# EAGLE board LEDSubMatrixHighDensity (EAGLE 9.6.2), part 1 of 2
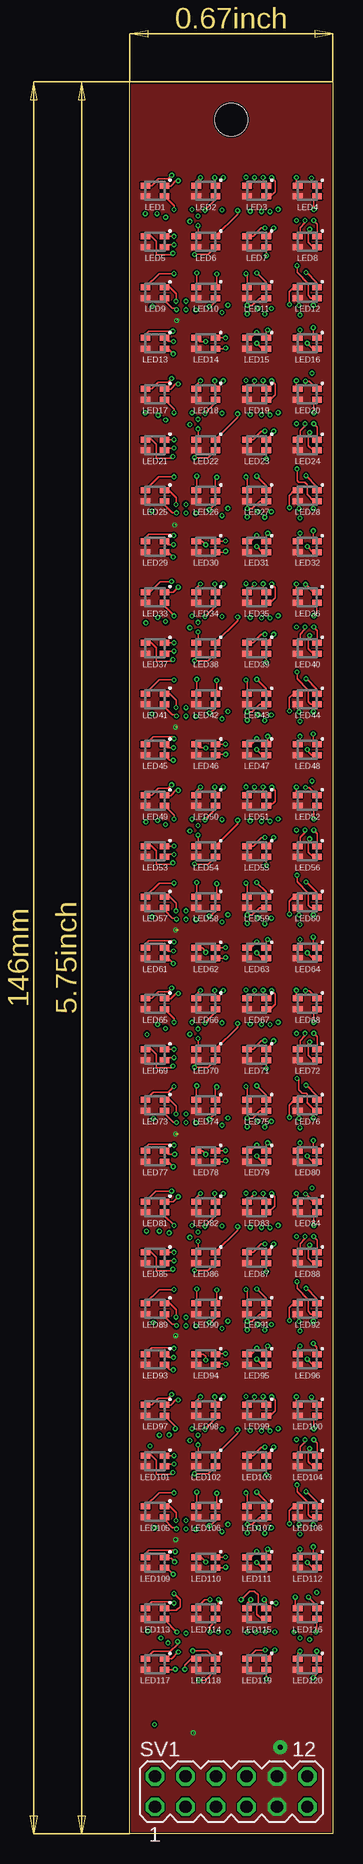
[diagram p3: board, top side]
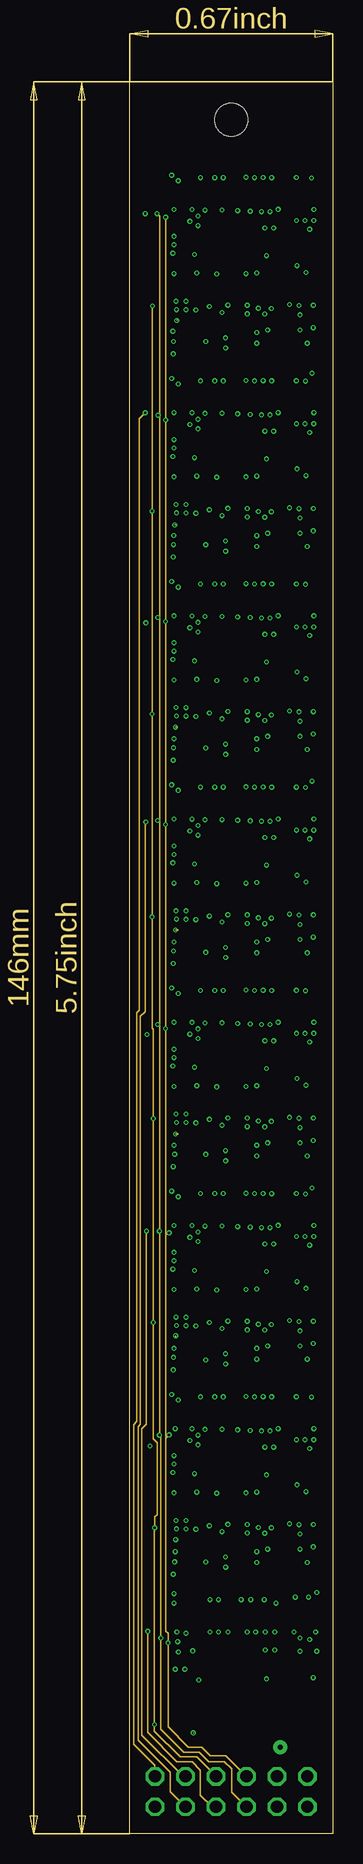
[diagram p4: board, inner layer InnerTop]
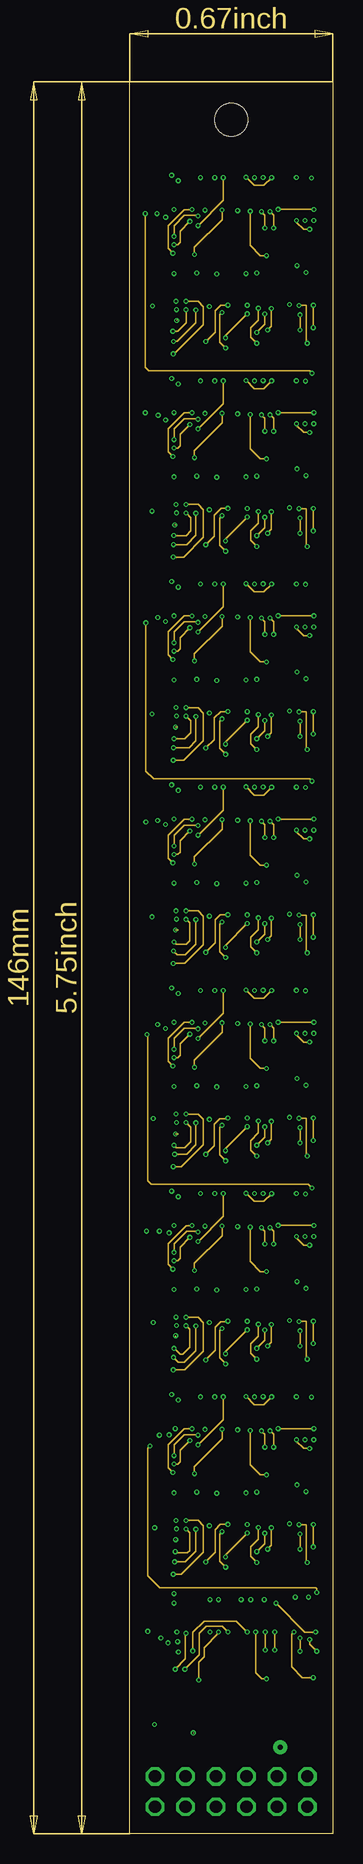
[diagram p5: board, inner layer InnerBottom]
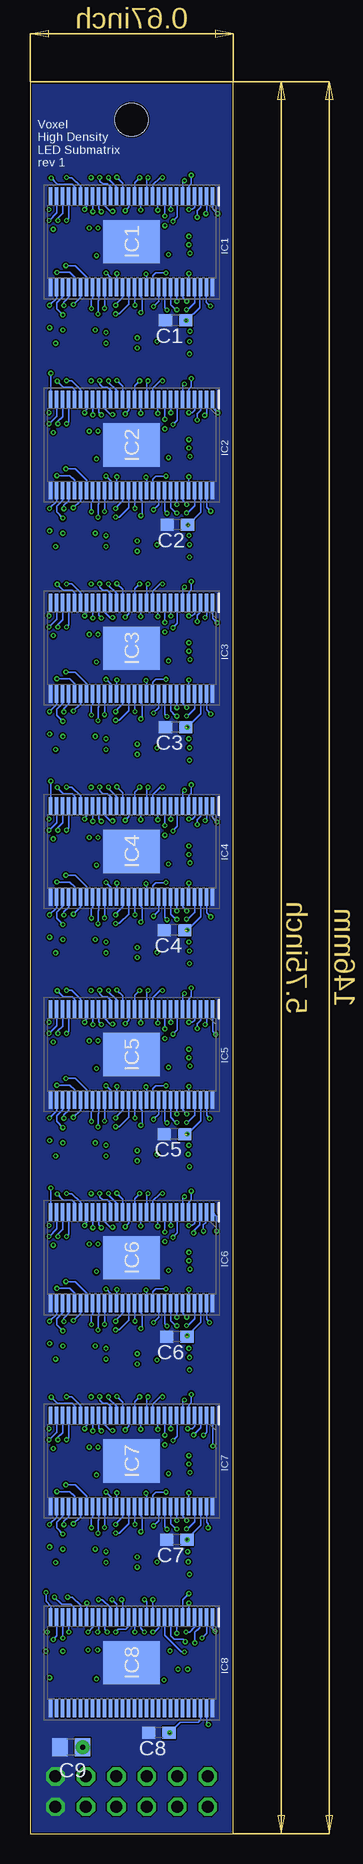
[diagram p6: board, bottom side, seen from below]

Size 16.93 x 146 mm. Coordinates in mm from the lower left corner, seen from the top.
Outline: 0,146 16.93,146 16.93,0 0,0 0,146
Copper layers (1+2*15+16): Top 0.035mm / dielectric 0.2mm / InnerTop 0.0175mm / dielectric 1.065mm / InnerBottom 0.0175mm / dielectric 0.2mm / Bottom 0.035mm
Design rules "jlcpcb_4layer_1oz": minimum track width 5mil, minimum drill 0.2mm, track to track 5mil, track to pad 0.2mm, pad to pad 5mil, via to via 6mil, smd to smd 5mil, copper to edge 5mil, drill to drill 0.5mm, minimum pad ring 10mil, minimum via ring 0.1mm, stop-mask expansion 4mil, vias tented up to drill 0mil, thermal gap 10mil
Holes 2.75 mm at 8.47,142.82

## Footprints (pad centres in the part's own frame; a part is rotated, then mirrored left to right if it is on the bottom)
C0603 = smd 1.1 x 1: 1 -0.85,0; 2 0.85,0
C0805 = smd 1.3 x 1.5: 1 -0.95,0; 2 0.95,0
SOP50P810X120-57N = smd 1.475 x 0.3: 1 -3.788,6.75; 2 -3.788,6.25; 3 -3.788,5.75; 4 -3.788,5.25; 5 -3.788,4.75; 6 -3.788,4.25; 7 -3.788,3.75; 8 -3.788,3.25; 9 -3.788,2.75; 10 -3.788,2.25; 11 -3.788,1.75; 12 -3.788,1.25; 13 -3.788,0.75; 14 -3.788,0.25; 15 -3.788,-0.25; 16 -3.788,-0.75; 17 -3.788,-1.25; 18 -3.788,-1.75; 19 -3.788,-2.25; 20 -3.788,-2.75; 21 -3.788,-3.25; 22 -3.788,-3.75; 23 -3.788,-4.25; 24 -3.788,-4.75; 25 -3.788,-5.25; 26 -3.788,-5.75; 27 -3.788,-6.25; 28 -3.788,-6.75; 29 3.788,-6.75; 30 3.788,-6.25; 31 3.788,-5.75; 32 3.788,-5.25; 33 3.788,-4.75; 34 3.788,-4.25; 35 3.788,-3.75; 36 3.788,-3.25; 37 3.788,-2.75; 38 3.788,-2.25; 39 3.788,-1.75; 40 3.788,-1.25; 41 3.788,-0.75; 42 3.788,-0.25; 43 3.788,0.25; 44 3.788,0.75; 45 3.788,1.25; 46 3.788,1.75; 47 3.788,2.25; 48 3.788,2.75; 49 3.788,3.25; 50 3.788,3.75; 51 3.788,4.25; 52 3.788,4.75; 53 3.788,5.25; 54 3.788,5.75; 55 3.788,6.25; 56 3.788,6.75 | smd 3.61 x 4.7: 57 0,0
B38G3RGB = smd 0.8 x 0.5: 1 0.8,0.45; 2 0.8,-0.45; 3 -0.8,-0.45; 4 -0.8,0.45
MA06-2 = drill 1.016 octagon: 1 -6.35,-1.27; 2 -6.35,1.27; 3 -3.81,-1.27; 4 -3.81,1.27; 5 -1.27,-1.27; 6 -1.27,1.27; 7 1.27,-1.27; 8 1.27,1.27; 9 3.81,-1.27; 10 3.81,1.27; 11 6.35,-1.27; 12 6.35,1.27

## Placement (x,y rotation side)
C1  .1uF  [C0603]  4.8,126.1 180 bottom
C2  .1uF  [C0603]  4.65,109.07 180 bottom
C3  .1uF  [C0603]  4.8,92.2 180 bottom
C4  .1uF  [C0603]  4.9,75.3 180 bottom
C5  .1uF  [C0603]  4.9,58.3 180 bottom
C6  .1uF  [C0603]  4.7,41.4 180 bottom
C7  .1uF  [C0603]  4.7,24.5 180 bottom
C8  .1uF  [C0603]  6.2,8.4 180 bottom
C9  10uF  [C0805]  13.5,7.2 180 bottom
IC1  TLC5955DCAR  [SOP50P810X120-57N]  8.47,132.65 270 bottom
IC2  TLC5955DCAR  [SOP50P810X120-57N]  8.47,115.72 270 bottom
IC3  TLC5955DCAR  [SOP50P810X120-57N]  8.47,98.78 270 bottom
IC4  TLC5955DCAR  [SOP50P810X120-57N]  8.47,81.85 270 bottom
IC5  TLC5955DCAR  [SOP50P810X120-57N]  8.47,64.92 270 bottom
IC6  TLC5955DCAR  [SOP50P810X120-57N]  8.47,47.98 270 bottom
IC7  TLC5955DCAR  [SOP50P810X120-57N]  8.47,31.05 270 bottom
IC8  TLC5955DCAR  [SOP50P810X120-57N]  8.47,14.23 270 bottom
LED1  B38G3RGB  [B38G3RGB]  2.12,136.88 0 top
LED2  B38G3RGB  [B38G3RGB]  6.35,136.88 0 top
LED3  B38G3RGB  [B38G3RGB]  10.58,136.88 0 top
LED4  B38G3RGB  [B38G3RGB]  14.82,136.88 0 top
LED5  B38G3RGB  [B38G3RGB]  2.12,132.65 0 top
LED6  B38G3RGB  [B38G3RGB]  6.35,132.65 0 top
LED7  B38G3RGB  [B38G3RGB]  10.58,132.65 0 top
LED8  B38G3RGB  [B38G3RGB]  14.82,132.65 0 top
LED9  B38G3RGB  [B38G3RGB]  2.12,128.42 0 top
LED10  B38G3RGB  [B38G3RGB]  6.35,128.42 0 top
LED11  B38G3RGB  [B38G3RGB]  10.58,128.42 0 top
LED12  B38G3RGB  [B38G3RGB]  14.82,128.42 0 top
LED13  B38G3RGB  [B38G3RGB]  2.12,124.18 0 top
LED14  B38G3RGB  [B38G3RGB]  6.35,124.18 0 top
LED15  B38G3RGB  [B38G3RGB]  10.58,124.18 0 top
LED16  B38G3RGB  [B38G3RGB]  14.82,124.18 0 top
LED17  B38G3RGB  [B38G3RGB]  2.12,119.95 0 top
LED18  B38G3RGB  [B38G3RGB]  6.35,119.95 0 top
LED19  B38G3RGB  [B38G3RGB]  10.58,119.95 0 top
LED20  B38G3RGB  [B38G3RGB]  14.82,119.95 0 top
LED21  B38G3RGB  [B38G3RGB]  2.12,115.72 0 top
LED22  B38G3RGB  [B38G3RGB]  6.35,115.72 0 top
LED23  B38G3RGB  [B38G3RGB]  10.58,115.72 0 top
LED24  B38G3RGB  [B38G3RGB]  14.82,115.72 0 top
LED25  B38G3RGB  [B38G3RGB]  2.12,111.48 0 top
LED26  B38G3RGB  [B38G3RGB]  6.35,111.48 0 top
LED27  B38G3RGB  [B38G3RGB]  10.58,111.48 0 top
LED28  B38G3RGB  [B38G3RGB]  14.82,111.48 0 top
LED29  B38G3RGB  [B38G3RGB]  2.12,107.25 0 top
LED30  B38G3RGB  [B38G3RGB]  6.35,107.25 0 top
LED31  B38G3RGB  [B38G3RGB]  10.58,107.25 0 top
LED32  B38G3RGB  [B38G3RGB]  14.82,107.25 0 top
LED33  B38G3RGB  [B38G3RGB]  2.12,103.02 0 top
LED34  B38G3RGB  [B38G3RGB]  6.35,103.02 0 top
LED35  B38G3RGB  [B38G3RGB]  10.58,103.02 0 top
LED36  B38G3RGB  [B38G3RGB]  14.82,103.02 0 top
LED37  B38G3RGB  [B38G3RGB]  2.12,98.78 0 top
LED38  B38G3RGB  [B38G3RGB]  6.35,98.78 0 top
LED39  B38G3RGB  [B38G3RGB]  10.58,98.78 0 top
LED40  B38G3RGB  [B38G3RGB]  14.82,98.78 0 top
LED41  B38G3RGB  [B38G3RGB]  2.12,94.55 0 top
LED42  B38G3RGB  [B38G3RGB]  6.35,94.55 0 top
LED43  B38G3RGB  [B38G3RGB]  10.58,94.55 0 top
LED44  B38G3RGB  [B38G3RGB]  14.82,94.55 0 top
LED45  B38G3RGB  [B38G3RGB]  2.12,90.32 0 top
LED46  B38G3RGB  [B38G3RGB]  6.35,90.32 0 top
LED47  B38G3RGB  [B38G3RGB]  10.58,90.32 0 top
LED48  B38G3RGB  [B38G3RGB]  14.82,90.32 0 top
LED49  B38G3RGB  [B38G3RGB]  2.12,86.08 0 top
LED50  B38G3RGB  [B38G3RGB]  6.35,86.08 0 top
LED51  B38G3RGB  [B38G3RGB]  10.58,86.08 0 top
LED52  B38G3RGB  [B38G3RGB]  14.82,86.08 0 top
LED53  B38G3RGB  [B38G3RGB]  2.12,81.85 0 top
LED54  B38G3RGB  [B38G3RGB]  6.35,81.85 0 top
LED55  B38G3RGB  [B38G3RGB]  10.58,81.85 0 top
LED56  B38G3RGB  [B38G3RGB]  14.82,81.85 0 top
LED57  B38G3RGB  [B38G3RGB]  2.12,77.62 0 top
LED58  B38G3RGB  [B38G3RGB]  6.35,77.62 0 top
LED59  B38G3RGB  [B38G3RGB]  10.58,77.62 0 top
LED60  B38G3RGB  [B38G3RGB]  14.82,77.62 0 top
LED61  B38G3RGB  [B38G3RGB]  2.12,73.38 0 top
LED62  B38G3RGB  [B38G3RGB]  6.35,73.38 0 top
LED63  B38G3RGB  [B38G3RGB]  10.58,73.38 0 top
LED64  B38G3RGB  [B38G3RGB]  14.82,73.38 0 top
LED65  B38G3RGB  [B38G3RGB]  2.12,69.15 0 top
LED66  B38G3RGB  [B38G3RGB]  6.35,69.15 0 top
LED67  B38G3RGB  [B38G3RGB]  10.58,69.15 0 top
LED68  B38G3RGB  [B38G3RGB]  14.82,69.15 0 top
LED69  B38G3RGB  [B38G3RGB]  2.12,64.92 0 top
LED70  B38G3RGB  [B38G3RGB]  6.35,64.92 0 top
LED71  B38G3RGB  [B38G3RGB]  10.58,64.92 0 top
LED72  B38G3RGB  [B38G3RGB]  14.82,64.92 0 top
LED73  B38G3RGB  [B38G3RGB]  2.12,60.68 0 top
LED74  B38G3RGB  [B38G3RGB]  6.35,60.68 0 top
LED75  B38G3RGB  [B38G3RGB]  10.58,60.68 0 top
LED76  B38G3RGB  [B38G3RGB]  14.82,60.68 0 top
LED77  B38G3RGB  [B38G3RGB]  2.12,56.45 0 top
LED78  B38G3RGB  [B38G3RGB]  6.35,56.45 0 top
LED79  B38G3RGB  [B38G3RGB]  10.58,56.45 0 top
LED80  B38G3RGB  [B38G3RGB]  14.82,56.45 0 top
LED81  B38G3RGB  [B38G3RGB]  2.12,52.22 0 top
LED82  B38G3RGB  [B38G3RGB]  6.35,52.22 0 top
LED83  B38G3RGB  [B38G3RGB]  10.58,52.22 0 top
LED84  B38G3RGB  [B38G3RGB]  14.82,52.22 0 top
LED85  B38G3RGB  [B38G3RGB]  2.12,47.98 0 top
LED86  B38G3RGB  [B38G3RGB]  6.35,47.98 0 top
LED87  B38G3RGB  [B38G3RGB]  10.58,47.98 0 top
LED88  B38G3RGB  [B38G3RGB]  14.82,47.98 0 top
LED89  B38G3RGB  [B38G3RGB]  2.12,43.75 0 top
LED90  B38G3RGB  [B38G3RGB]  6.35,43.75 0 top
LED91  B38G3RGB  [B38G3RGB]  10.58,43.75 0 top
LED92  B38G3RGB  [B38G3RGB]  14.82,43.75 0 top
LED93  B38G3RGB  [B38G3RGB]  2.12,39.52 0 top
LED94  B38G3RGB  [B38G3RGB]  6.35,39.52 0 top
LED95  B38G3RGB  [B38G3RGB]  10.58,39.52 0 top
LED96  B38G3RGB  [B38G3RGB]  14.82,39.52 0 top
LED97  B38G3RGB  [B38G3RGB]  2.12,35.28 0 top
LED98  B38G3RGB  [B38G3RGB]  6.35,35.28 0 top
LED99  B38G3RGB  [B38G3RGB]  10.58,35.28 0 top
LED100  B38G3RGB  [B38G3RGB]  14.82,35.28 0 top
LED101  B38G3RGB  [B38G3RGB]  2.12,31.05 0 top
LED102  B38G3RGB  [B38G3RGB]  6.35,31.05 0 top
LED103  B38G3RGB  [B38G3RGB]  10.58,31.05 0 top
LED104  B38G3RGB  [B38G3RGB]  14.82,31.05 0 top
LED105  B38G3RGB  [B38G3RGB]  2.12,26.82 0 top
LED106  B38G3RGB  [B38G3RGB]  6.35,26.82 0 top
LED107  B38G3RGB  [B38G3RGB]  10.58,26.82 0 top
LED108  B38G3RGB  [B38G3RGB]  14.82,26.82 0 top
LED109  B38G3RGB  [B38G3RGB]  2.12,22.58 0 top
LED110  B38G3RGB  [B38G3RGB]  6.35,22.58 0 top
LED111  B38G3RGB  [B38G3RGB]  10.58,22.58 0 top
LED112  B38G3RGB  [B38G3RGB]  14.82,22.58 0 top
LED113  B38G3RGB  [B38G3RGB]  2.12,18.35 0 top
LED114  B38G3RGB  [B38G3RGB]  6.35,18.35 0 top
LED115  B38G3RGB  [B38G3RGB]  10.58,18.35 0 top
LED116  B38G3RGB  [B38G3RGB]  14.82,18.35 0 top
LED117  B38G3RGB  [B38G3RGB]  2.12,14.12 0 top
LED118  B38G3RGB  [B38G3RGB]  6.35,14.12 0 top
LED119  B38G3RGB  [B38G3RGB]  10.58,14.12 0 top
LED120  B38G3RGB  [B38G3RGB]  14.82,14.12 0 top
SV1  [MA06-2]  8.47,3.5 0 top

## Tracks (layer width: path | path; a pad name or v marks a point on that pad's centre or on a via)
3V3  (via drill 0.2, 0.4 pad 1.15)  (8 unrouted)
  Bottom 0.127: IC7.54 2.72,25.68 3.84,24.56 v3.84,24.5 | IC6.54 2.72,42.62 v3.84,41.5 | IC2.54 2.72,110.09 v3.76,109.05 | IC3.54 2.72,93.3 v3.82,92.2 | IC4.54 2.72,76.4 v3.82,75.3 | IC5.54 2.72,59.4 v3.82,58.3 | IC1.54 2.8,128.78 2.8,127.16 3.87,126.1 v3.92,126.1 | IC8.54 2.72,9.48 2.9,9.3 4.4,9.3 v5.3,8.4
  other vias: 12.55,7.2
  pour Top (no thermals): -20,166 40,166 40,-6 -20,-6
GND
  pour Bottom (no thermals): -20,166 38.2,166 38.2,-3 -20,-3
GSCLK  (via drill 0.2)
  InnerTop 0.127: v1.9,127.3 1.87,127.27 v1.87,110.2 v1.87,93.3 v1.87,76.4 1.87,67.13 1.97,67.03 v1.97,59.6 v1.97,42.6 v1.98,42.59 1.98,32.9 2.29,32.59 2.29,26.59 2.09,26.39 v2.09,25.49 2.07,25.47 v2.07,9.1 2.07,8.53 4.2,6.4 5.6,6.4 7.2,4.8 SV1.6
  Bottom 0.127: IC1.55 2.23,127.61 1.92,127.3 v1.9,127.3 | IC3.55 2.22,93.65 v1.87,93.3 | IC6.55 2.22,42.85 v1.97,42.6 | IC5.55 2.22,59.85 v1.97,59.6 | IC4.55 2.22,76.75 v1.87,76.4 | IC2.55 2.22,110.55 v1.87,110.2 | IC7.55 2.22,25.95 2.09,25.82 v2.09,25.49 | IC8.55 2.22,9.25 v2.07,9.1
LAT  (via drill 0.2)
  InnerTop 0.127: 3.02,32.95 3.02,16.88 3.2,16.7 v3.2,15.9 3.2,8.9 4.9,7.2 6,7.2 6.7,6.5 8.01,6.5 SV1.8 | v3,134.7 v3,117.8 v3,101 v3,84.1 v3,67.1 3,49.98 3.02,49.96 | v3.3,50.06 3.2,49.96 3.02,49.96 | v3.3,33.23 3.02,32.95 | 3.02,49.96 3.02,32.95
  Bottom 0.127: IC1.3 2.72,135.54 3,135.25 v3,134.7 | IC2.3 2.72,118.61 3,118.32 v3,117.8 | IC4.3 2.72,84.78 3,84.5 v3,84.1 | IC5.3 2.72,67.78 3,67.5 v3,67.1 | IC3.3 2.8,102.48 2.8,101.72 3,101.52 v3,101 | IC6.3 2.8,51.69 2.8,50.75 3.3,50.25 v3.3,50.06 | IC7.3 2.72,33.81 v3.3,33.23 | IC8.3 2.8,17.94 2.8,17.18 3.2,16.78 v3.2,15.9
N$LEDB1_IC1_PIN4  (via drill 0.2 pad 0.4)
  Top 0.127: LED1.2 3.7,135.65 v3.7,135.35
  Bottom 0.127: IC1.4 3.22,135.53 3.4,135.35 v3.7,135.35
N$LEDB2_IC1_PIN10  (via drill 0.2)
  Top 0.127: v6.28,135.29 7.15,136.16 LED2.2
  Bottom 0.127: IC1.10 6.28,136.37 v6.28,135.29
N$LEDB3_IC1_PIN16  (via drill 0.2)
  Top 0.127: v11.84,138 12.14,137.7 12.14,136.84 11.73,136.43 LED3.2
  InnerBottom 0.127: v11.84,138 11.18,137.35 10.38,137.35 v9.7,138.03
  Bottom 0.127: IC1.16 9.22,137.55 v9.7,138.03
N$LEDB4_IC1_PIN22  (via drill 0.2)
  Top 0.127: LED4.2 15.35,136.17 v15.35,135.35
  InnerBottom 0.127: v15.35,135.35 v12.38,135.35
  Bottom 0.127: IC1.22 12.22,135.63 12.38,135.46 v12.38,135.35
N$LEDB5_IC1_PIN7  (via drill 0.2 pad 0.4)
  Top 0.127: v3.7,132.4 3.12,132.4 LED5.2
  InnerBottom 0.127: v5.02,134.36 4.2,133.54 4.2,132.6 4,132.4 v3.7,132.4
  Bottom 0.127: IC1.7 4.65,136.37 4.65,134.73 v5.02,134.36
N$LEDB6_IC1_PIN13  (via drill 0.2)
  Top 0.127: v5.4,131.6 6.55,131.6 LED6.2
  InnerBottom 0.127: v7.71,135.29 7.71,134.49 5.4,132.19 v5.4,131.6
  Bottom 0.127: IC1.13 7.72,135.3 v7.71,135.29
N$LEDB7_IC1_PIN19  (via drill 0.2)
  Top 0.127: v11.4,131.5 11.38,131.52 LED7.2
  InnerBottom 0.127: v10.05,135.2 10.05,132.35 10.9,131.5 v11.4,131.5
  Bottom 0.127: IC1.19 10.72,135.67 10.25,135.2 v10.05,135.2
N$LEDB8_IC1_PIN25  (via drill 0.2)
  Top 0.127: v15,133.7 14.9,133.6 14.9,132.6 15.3,132.2 LED8.2
  InnerBottom 0.127: v15,133.7 14.5,133.7 13.9,134.3 v13.9,134.42
  Bottom 0.127: IC1.25 13.72,134.61 v13.9,134.42
N$LEDB9_IC1_PIN53  (via drill 0.2)
  Top 0.127: v3.9,127 3.8,127.1 3.56,127.1 2.92,127.74 LED9.2
  Bottom 0.127: IC1.53 3.22,127.58 3.8,127 v3.9,127
N$LEDB10_IC1_PIN47  (via drill 0.2)
  Top 0.127: v6.65,127.25 6.74,127.25 7.15,127.67 LED10.2
  Bottom 0.127: IC1.47 6.22,127.68 v6.65,127.25
N$LEDB11_IC1_PIN41  (via drill 0.2)
  Top 0.127: v9.8,127.36 v9.8,127.37 10.23,127.37 10.83,127.97 LED11.2
  Bottom 0.127: IC1.41 9.22,128.02 9.8,127.44 v9.8,127.36
N$LEDB12_IC1_PIN35  (via drill 0.2)
  Top 0.127: v13.95,130.66 13.95,130.11 14.9,129.16 14.9,128.18 15.11,127.97 LED12.2
  Bottom 0.127: IC1.35 12.22,129.7 13.17,130.66 v13.95,130.66
N$LEDB13_IC1_PIN50  (via drill 0.2)
  Top 0.127: v3.64,123.31 3.22,123.73 LED13.2
  InnerBottom 0.127: v4.69,127.7 5.7,127.7 6.15,127.25 6.15,125.75 3.71,123.31 v3.64,123.31
  Bottom 0.127: IC1.50 4.72,127.72 v4.69,127.7
N$LEDB14_IC1_PIN44  (via drill 0.2)
  Top 0.127: v8,123.8 7.93,123.73 LED14.2
  InnerBottom 0.127: v7.7,126.76 7.5,126.56 7.5,124.3 v8,123.8
  Bottom 0.127: IC1.44 7.72,128.08 7.6,127.96 7.6,126.86 v7.7,126.76
N$LEDB15_IC1_PIN38  (via drill 0.2)
  Top 0.127: LED15.2 11.07,123.73 v10.6,124.2
  InnerBottom 0.127: v10.6,124.2 10.1,124.7 10.1,125.49 10.73,126.12 v10.73,127.11
  Bottom 0.127: IC1.38 10.72,127.13 v10.73,127.11
N$LEDB16_IC1_PIN32  (via drill 0.2)
  Top 0.127: v14.8,124.2 15.27,123.73 LED16.2
  InnerBottom 0.127: v14.11,127.34 14.7,127.34 14.7,124.3 v14.8,124.2
  Bottom 0.127: IC1.32 13.72,128.02 14.11,127.62 v14.11,127.34
N$LEDB17_IC2_PIN4  (via drill 0.2 pad 0.4)
  Top 0.127: LED17.2 3.7,118.72 v3.7,118.41
  Bottom 0.127: IC2.4 3.22,118.6 3.4,118.41 v3.7,118.41
N$LEDB18_IC2_PIN10  (via drill 0.2)
  Top 0.127: v6.28,118.36 7.15,119.23 LED18.2
  Bottom 0.127: IC2.10 6.28,119.44 v6.28,118.36
N$LEDB19_IC2_PIN16  (via drill 0.2)
  Top 0.127: v11.84,121.07 12.14,120.77 12.14,119.9 11.73,119.5 LED19.2
  InnerBottom 0.127: v11.84,121.07 11.18,120.41 10.38,120.41 v9.7,121.1
  Bottom 0.127: IC2.16 9.22,120.61 v9.7,121.1
N$LEDB20_IC2_PIN22  (via drill 0.2)
  Top 0.127: LED20.2 15.35,119.24 v15.35,118.41
  InnerBottom 0.127: v15.35,118.41 v15.35,118.42 v12.38,118.42
  Bottom 0.127: IC2.22 12.22,118.69 12.38,118.53 v12.38,118.42
N$LEDB21_IC2_PIN7  (via drill 0.2 pad 0.4)
  Top 0.127: v3.7,115.47 3.12,115.47 LED21.2
  InnerBottom 0.127: v5.02,117.42 4.2,116.61 4.2,115.67 4,115.47 v3.7,115.47
  Bottom 0.127: IC2.7 4.65,119.44 4.65,117.79 v5.02,117.42
N$LEDB22_IC2_PIN13  (via drill 0.2)
  Top 0.127: v5.4,114.66 6.55,114.66 LED22.2
  InnerBottom 0.127: v7.71,118.36 7.71,117.56 5.4,115.25 v5.4,114.66
  Bottom 0.127: IC2.13 v7.72,118.37 v7.71,118.36
N$LEDB23_IC2_PIN19  (via drill 0.2)
  Top 0.127: v11.4,114.57 11.38,114.58 LED23.2
  InnerBottom 0.127: v10.05,118.27 10.05,115.42 10.9,114.57 v11.4,114.57
  Bottom 0.127: IC2.19 10.72,118.73 10.25,118.27 v10.05,118.27
N$LEDB24_IC2_PIN25  (via drill 0.2)
  Top 0.127: v15,116.77 14.9,116.67 14.9,115.67 15.3,115.27 LED24.2
  InnerBottom 0.127: v15,116.77 14.5,116.77 13.9,117.37 v13.9,117.49
  Bottom 0.127: IC2.25 13.72,117.67 v13.9,117.49
N$LEDB25_IC2_PIN53  (via drill 0.2)
  Top 0.127: LED25.2 2.92,110.68 3.53,110.07 v3.9,110.07
  Bottom 0.127: IC2.53 3.22,110.65 3.8,110.07 v3.9,110.07
N$LEDB26_IC2_PIN47  (via drill 0.2)
  Top 0.127: v6.65,110.32 7.15,110.82 LED26.2
  Bottom 0.127: IC2.47 6.22,110.75 v6.65,110.32
N$LEDB27_IC2_PIN41  (via drill 0.2)
  Top 0.127: v9.8,110.43 10.23,110.43 10.83,111.03 LED27.2 | LED27.2
  Bottom 0.127: IC2.41 9.22,111.09 9.8,110.5 v9.8,110.43
N$LEDB28_IC2_PIN35  (via drill 0.2)
  Top 0.127: v13.95,113.73 13.95,112.75 14.1,112.6 14.6,112.6 14.8,112.4 14.8,111.6 15.37,111.03 LED28.2
  Bottom 0.127: IC2.35 12.22,112.77 13.17,113.73 v13.95,113.73
N$LEDB29_IC2_PIN50  (via drill 0.2)
  Top 0.127: v3.64,106.38 3.22,106.8 LED29.2
  InnerBottom 0.127: v4.69,110.77 5.7,110.77 6.15,110.31 6.15,108.02 4.51,106.38 v3.64,106.38
  Bottom 0.127: IC2.50 4.72,110.79 v4.69,110.77
N$LEDB30_IC2_PIN44  (via drill 0.2)
  Top 0.127: v8,106.87 7.93,106.8 LED30.2
  InnerBottom 0.127: v7.7,109.83 7.5,109.63 7.5,107.37 v8,106.87
  Bottom 0.127: IC2.44 7.72,111.15 7.6,111.03 7.6,109.93 v7.7,109.83
N$LEDB31_IC2_PIN38  (via drill 0.2)
  Top 0.127: LED31.2 11.07,106.8 v10.6,107.27
  InnerBottom 0.127: v10.6,107.27 10.1,107.77 10.1,108.56 10.73,109.19 v10.73,110.18
  Bottom 0.127: IC2.38 10.72,110.19 v10.73,110.18
N$LEDB32_IC2_PIN32  (via drill 0.2)
  Top 0.127: v14.8,107.27 15.27,106.8 LED32.2
  InnerBottom 0.127: v14.11,110.41 14.7,110.41 14.7,107.37 v14.8,107.27
  Bottom 0.127: IC2.32 13.72,111.08 14.11,110.69 v14.11,110.41
N$LEDB33_IC3_PIN4  (via drill 0.2 pad 0.4)
  Top 0.127: LED33.2 2.92,102.27 v3.7,101.48
  Bottom 0.127: IC3.4 3.22,101.66 3.4,101.48 v3.7,101.48
N$LEDB34_IC3_PIN10  (via drill 0.2)
  Top 0.127: LED34.2 7.15,102.29 v6.28,101.42
  Bottom 0.127: IC3.10 6.28,102.51 v6.28,101.42
N$LEDB35_IC3_PIN16  (via drill 0.2)
  Top 0.127: v11.84,104.13 12.14,103.83 12.14,102.97 11.73,102.57 LED35.2
  InnerBottom 0.127: v11.84,104.13 11.18,103.48 10.38,103.48 v9.7,104.16
  Bottom 0.127: IC3.16 9.22,103.68 v9.7,104.16
N$LEDB36_IC3_PIN22  (via drill 0.2)
  Top 0.127: v15.35,101.48 15.62,101.74 LED36.2
  InnerBottom 0.127: v15.35,101.48 v12.38,101.48
  Bottom 0.127: IC3.22 12.22,101.76 12.38,101.6 v12.38,101.48
N$LEDB37_IC3_PIN7  (via drill 0.2 pad 0.4)
  Top 0.127: v3.7,98.53 3.12,98.53 LED37.2
  InnerBottom 0.127: v5.02,100.49 4.2,99.67 4.2,98.73 4,98.53 v3.7,98.53
  Bottom 0.127: IC3.7 4.65,102.5 4.65,100.86 v5.02,100.49
N$LEDB38_IC3_PIN13  (via drill 0.2)
  Top 0.127: v5.4,97.73 6.55,97.73 LED38.2
  InnerBottom 0.127: v7.71,101.43 7.71,100.63 5.4,98.32 v5.4,97.73
  Bottom 0.127: IC3.13 v7.72,101.44 v7.71,101.43
N$LEDB39_IC3_PIN19  (via drill 0.2)
  Top 0.127: v11.4,97.63 11.38,97.65 LED39.2
  InnerBottom 0.127: v10.05,101.33 10.05,98.48 10.9,97.63 v11.4,97.63
  Bottom 0.127: IC3.19 10.72,101.8 10.25,101.33 v10.05,101.33
N$LEDB40_IC3_PIN25  (via drill 0.2)
  Top 0.127: v15,99.83 14.9,99.73 14.9,98.73 15.3,98.33 LED40.2
  InnerBottom 0.127: v15,99.83 14.5,99.83 13.9,100.43 v13.9,100.56
  Bottom 0.127: IC3.25 13.72,100.74 v13.9,100.56
N$LEDB41_IC3_PIN53  (via drill 0.2)
  Top 0.127: v3.9,93.13 3.8,93.23 3.56,93.23 2.92,93.88 LED41.2
  Bottom 0.127: IC3.53 3.22,93.72 3.8,93.13 v3.9,93.13
N$LEDB42_IC3_PIN47  (via drill 0.2)
  Top 0.127: v6.65,93.39 6.74,93.39 7.15,93.8 LED42.2
  Bottom 0.127: IC3.47 6.22,93.82 v6.65,93.39
N$LEDB43_IC3_PIN41  (via drill 0.2)
  Top 0.127: v9.8,93.5 10.23,93.5 10.83,94.1 LED43.2
  Bottom 0.127: IC3.41 9.22,94.15 9.8,93.57 v9.8,93.5
N$LEDB44_IC3_PIN35  (via drill 0.2)
  Top 0.127: v13.95,96.79 13.95,96.24 14.9,95.29 14.9,94.31 15.11,94.1 LED44.2
  Bottom 0.127: IC3.35 12.22,95.84 13.17,96.79 v13.95,96.79
N$LEDB45_IC3_PIN50  (via drill 0.2)
  Top 0.127: v3.64,89.45 3.34,89.45 LED45.2
  InnerBottom 0.127: v4.69,93.83 5.7,93.83 6.15,93.38 6.15,91.09 4.51,89.45 v3.64,89.45
  Bottom 0.127: IC3.50 4.72,93.86 v4.69,93.83
N$LEDB46_IC3_PIN44  (via drill 0.2)
  Top 0.127: LED46.2 7.22,89.93 v8,89.93
  InnerBottom 0.127: v7.7,92.9 7.5,92.7 7.5,90.43 v8,89.93
  Bottom 0.127: IC3.44 7.72,94.21 7.6,94.1 7.6,93 v7.7,92.9
N$LEDB47_IC3_PIN38  (via drill 0.2)
  Top 0.127: 11.08,89.87 11.07,89.87 v10.6,90.33 | LED47.2 11.08,89.87 | 11.08,89.87
  InnerBottom 0.127: v10.6,90.33 10.1,90.83 10.1,91.62 10.73,92.26 v10.73,93.24
  Bottom 0.127: IC3.38 10.72,93.26 v10.73,93.24
N$LEDB48_IC3_PIN32  (via drill 0.2)
  Top 0.127: LED48.2 15.17,89.87 14.8,90.23 v14.8,90.33
  InnerBottom 0.127: v14.11,93.48 14.7,93.48 14.7,90.43 v14.8,90.33
  Bottom 0.127: IC3.32 13.72,94.15 14.11,93.76 v14.11,93.48
N$LEDB49_IC4_PIN4  (via drill 0.2 pad 0.4)
  Top 0.127: LED49.2 3.7,84.85 v3.7,84.55
  Bottom 0.127: IC4.4 3.22,84.73 3.4,84.55 v3.7,84.55
N$LEDB50_IC4_PIN10  (via drill 0.2)
  Top 0.127: v6.28,84.49 7.15,85.36 LED50.2
  Bottom 0.127: IC4.10 6.28,85.57 v6.28,84.49
N$LEDB51_IC4_PIN16  (via drill 0.2)
  Top 0.127: v11.84,87.2 12.14,86.9 12.14,86.04 11.73,85.63 LED51.2
  InnerBottom 0.127: v11.84,87.2 11.18,86.55 10.38,86.55 v9.7,87.23
  Bottom 0.127: IC4.16 9.22,86.75 v9.7,87.23
N$LEDB52_IC4_PIN22  (via drill 0.2)
  Top 0.127: LED52.2 15.35,85.37 v15.35,84.55
  InnerBottom 0.127: v15.35,84.55 v12.38,84.55
  Bottom 0.127: IC4.22 12.22,84.83 12.38,84.66 v12.38,84.55
N$LEDB53_IC4_PIN7  (via drill 0.2 pad 0.4)
  Top 0.127: v3.7,81.6 3.12,81.6 LED53.2
  InnerBottom 0.127: v5.02,83.56 4.2,82.74 4.2,81.8 4,81.6 v3.7,81.6
  Bottom 0.127: IC4.7 4.65,85.57 4.65,83.93 v5.02,83.56
N$LEDB54_IC4_PIN13  (via drill 0.2)
  Top 0.127: v5.4,80.8 6.55,80.8 LED54.2
  InnerBottom 0.127: v7.71,84.49 7.71,83.69 5.4,81.39 v5.4,80.8
  Bottom 0.127: IC4.13 7.72,84.5 v7.71,84.49
N$LEDB55_IC4_PIN19  (via drill 0.2)
  Top 0.127: v11.4,80.7 11.38,80.72 LED55.2
  InnerBottom 0.127: v10.05,84.4 10.05,81.55 10.9,80.7 v11.4,80.7
  Bottom 0.127: IC4.19 10.72,84.87 10.25,84.4 v10.05,84.4
N$LEDB56_IC4_PIN25  (via drill 0.2)
  Top 0.127: v15,82.9 14.9,82.8 14.9,81.8 15.3,81.4 LED56.2
  InnerBottom 0.127: v15,82.9 14.5,82.9 13.9,83.5 v13.9,83.62
  Bottom 0.127: IC4.25 13.72,83.81 v13.9,83.62
N$LEDB57_IC4_PIN53  (via drill 0.2)
  Top 0.127: v3.9,76.2 3.8,76.3 3.56,76.3 2.92,76.94 LED57.2
  Bottom 0.127: IC4.53 3.22,76.78 3.8,76.2 v3.9,76.2
N$LEDB58_IC4_PIN47  (via drill 0.2)
  Top 0.127: v6.65,76.45 6.74,76.45 7.15,76.87 LED58.2
  Bottom 0.127: IC4.47 6.22,76.88 v6.65,76.45
N$LEDB59_IC4_PIN41  (via drill 0.2)
  Top 0.127: v9.8,76.56 v9.8,76.57 10.23,76.57 10.83,77.17 LED59.2
  Bottom 0.127: IC4.41 9.22,77.22 9.8,76.64 v9.8,76.56
N$LEDB60_IC4_PIN35  (via drill 0.2)
  Top 0.127: v13.95,79.86 13.95,79.31 14.9,78.36 14.9,77.38 15.11,77.17 LED60.2
  Bottom 0.127: IC4.35 12.22,78.9 13.17,79.86 v13.95,79.86
N$LEDB61_IC4_PIN50  (via drill 0.2)
  Top 0.127: v3.64,72.51 3.22,72.93 LED61.2
  InnerBottom 0.127: v4.69,76.9 5.7,76.9 6.15,76.45 6.15,74.05 4.61,72.51 v3.64,72.51
  Bottom 0.127: IC4.50 4.72,76.92 v4.69,76.9
N$LEDB62_IC4_PIN44  (via drill 0.2)
  Top 0.127: v8,73 7.93,72.93 LED62.2
  InnerBottom 0.127: v7.7,75.96 7.5,75.76 7.5,73.5 v8,73
  Bottom 0.127: IC4.44 7.72,77.28 7.6,77.16 7.6,76.06 v7.7,75.96
N$LEDB63_IC4_PIN38  (via drill 0.2)
  Top 0.127: LED63.2 11.07,72.93 v10.6,73.4
  InnerBottom 0.127: v10.6,73.4 10.1,73.9 10.1,74.69 10.73,75.32 v10.73,76.31
  Bottom 0.127: IC4.38 10.72,76.33 v10.73,76.31
N$LEDB64_IC4_PIN32  (via drill 0.2)
  Top 0.127: v14.8,73.4 15.27,72.93 LED64.2
  InnerBottom 0.127: v14.11,76.54 14.7,76.54 14.7,73.5 v14.8,73.4
  Bottom 0.127: IC4.32 13.72,77.22 14.11,76.82 v14.11,76.54
N$LEDB65_IC5_PIN4  (via drill 0.2 pad 0.4)
  Top 0.127: LED65.2 3.7,67.92 v3.7,67.61
  Bottom 0.127: IC5.4 3.22,67.8 3.4,67.61 v3.7,67.61
N$LEDB66_IC5_PIN10  (via drill 0.2)
  Top 0.127: v6.28,67.56 7.15,68.43 LED66.2
  Bottom 0.127: IC5.10 6.28,68.64 v6.28,67.56
N$LEDB67_IC5_PIN16  (via drill 0.2)
  Top 0.127: v11.84,70.27 12.14,69.97 12.14,69.1 11.73,68.7 LED67.2
  InnerBottom 0.127: v11.84,70.27 11.18,69.61 10.38,69.61 v9.7,70.3
  Bottom 0.127: IC5.16 9.22,69.81 v9.7,70.3
N$LEDB68_IC5_PIN22  (via drill 0.2)
  Top 0.127: LED68.2 15.35,68.44 v15.35,67.61
  InnerBottom 0.127: v15.35,67.61 v15.35,67.62 v12.38,67.62
  Bottom 0.127: IC5.22 12.22,67.89 12.38,67.73 v12.38,67.62
N$LEDB69_IC5_PIN7  (via drill 0.2 pad 0.4)
  Top 0.127: v3.7,64.67 3.12,64.67 LED69.2
  InnerBottom 0.127: v5.02,66.62 4.2,65.81 4.2,64.87 4,64.67 v3.7,64.67
  Bottom 0.127: IC5.7 4.65,68.64 4.65,66.99 v5.02,66.62
N$LEDB70_IC5_PIN13  (via drill 0.2)
  Top 0.127: v5.4,63.86 6.55,63.86 LED70.2
  InnerBottom 0.127: v7.71,67.56 7.71,66.76 5.4,64.45 v5.4,63.86
  Bottom 0.127: IC5.13 v7.72,67.57 v7.71,67.56
N$LEDB71_IC5_PIN19  (via drill 0.2)
  Top 0.127: v11.4,63.77 11.38,63.78 LED71.2
  InnerBottom 0.127: v10.05,67.47 10.05,64.62 10.9,63.77 v11.4,63.77
  Bottom 0.127: IC5.19 10.72,67.93 10.25,67.47 v10.05,67.47
N$LEDB72_IC5_PIN25  (via drill 0.2)
  Top 0.127: v15,65.97 14.9,65.87 14.9,64.87 15.3,64.47 LED72.2
  InnerBottom 0.127: v15,65.97 14.5,65.97 13.9,66.57 v13.9,66.69
  Bottom 0.127: IC5.25 13.72,66.87 v13.9,66.69
N$LEDB73_IC5_PIN53  (via drill 0.2)
  Top 0.127: LED73.2 2.92,59.98 3.63,59.27 v3.9,59.27
  Bottom 0.127: IC5.53 3.22,59.85 3.8,59.27 v3.9,59.27
N$LEDB74_IC5_PIN47  (via drill 0.2)
  Top 0.127: v6.65,59.52 7.15,60.02 LED74.2
  Bottom 0.127: IC5.47 6.22,59.95 v6.65,59.52
N$LEDB75_IC5_PIN41  (via drill 0.2)
  Top 0.127: v9.8,59.63 10.25,59.63 10.86,60.23 LED75.2
  Bottom 0.127: IC5.41 9.22,60.29 9.8,59.7 v9.8,59.63
N$LEDB76_IC5_PIN35  (via drill 0.2)
  Top 0.127: v13.95,62.93 14.1,62.78 14.1,62 14.4,61.7 14.7,61.7 14.8,61.6 14.8,60.9 15.47,60.23 LED76.2
  Bottom 0.127: IC5.35 12.22,61.97 13.17,62.93 v13.95,62.93
N$LEDB77_IC5_PIN50  (via drill 0.2)
  Top 0.127: v3.64,55.58 3.22,56 LED77.2
  InnerBottom 0.127: v4.69,59.97 5.7,59.97 6.15,59.52 6.15,57.42 4.31,55.58 v3.64,55.58
  Bottom 0.127: IC5.50 4.72,59.99 v4.69,59.97
N$LEDB78_IC5_PIN44  (via drill 0.2)
  Top 0.127: v8,56.07 7.93,56 LED78.2
  InnerBottom 0.127: v7.7,59.03 7.5,58.83 7.5,56.57 v8,56.07
  Bottom 0.127: IC5.44 7.72,60.35 7.6,60.23 7.6,59.13 v7.7,59.03
N$LEDB79_IC5_PIN38  (via drill 0.2)
  Top 0.127: LED79.2 11.07,56 v10.6,56.47
  InnerBottom 0.127: v10.6,56.47 10.1,56.97 10.1,57.76 10.73,58.39 v10.73,59.38
  Bottom 0.127: IC5.38 10.72,59.39 v10.73,59.38
N$LEDB80_IC5_PIN32  (via drill 0.2)
  Top 0.127: v14.8,56.47 15.27,56 LED80.2
  InnerBottom 0.127: v14.11,59.61 14.7,59.61 14.7,56.57 v14.8,56.47
  Bottom 0.127: IC5.32 13.72,60.28 14.11,59.89 v14.11,59.61
N$LEDB81_IC6_PIN4  (via drill 0.2 pad 0.4)
  Top 0.127: LED81.2 2.92,51.47 v3.7,50.68
  Bottom 0.127: IC6.4 3.22,50.86 3.4,50.68 v3.7,50.68
N$LEDB82_IC6_PIN10  (via drill 0.2)
  Top 0.127: LED82.2 7.15,51.49 v6.28,50.62
  Bottom 0.127: IC6.10 6.28,51.71 v6.28,50.62
N$LEDB83_IC6_PIN16  (via drill 0.2)
  Top 0.127: v11.84,53.33 12.1,53.07 12.1,52.3 11.57,51.77 LED83.2
  InnerBottom 0.127: v11.84,53.33 11.18,52.68 10.38,52.68 v9.7,53.36
  Bottom 0.127: IC6.16 9.22,52.88 v9.7,53.36
N$LEDB84_IC6_PIN22  (via drill 0.2)
  Top 0.127: v15.35,50.68 15.35,51.5 LED84.2 | LED84.2
  InnerBottom 0.127: v15.35,50.68 v12.38,50.68
  Bottom 0.127: IC6.22 12.22,50.96 12.38,50.8 v12.38,50.68
N$LEDB85_IC6_PIN7  (via drill 0.2 pad 0.4)
  Top 0.127: v3.7,47.73 3.12,47.73 LED85.2
  InnerBottom 0.127: v5.02,49.69 4.2,48.87 4.2,47.93 4,47.73 v3.7,47.73
  Bottom 0.127: IC6.7 4.65,51.7 4.65,50.06 v5.02,49.69
N$LEDB86_IC6_PIN13  (via drill 0.2)
  Top 0.127: v5.4,46.93 6.55,46.93 LED86.2
  InnerBottom 0.127: v7.71,50.63 7.71,49.83 5.4,47.52 v5.4,46.93
  Bottom 0.127: IC6.13 v7.72,50.64 v7.71,50.63
N$LEDB87_IC6_PIN19  (via drill 0.2)
  Top 0.127: v11.4,46.83 11.38,46.85 LED87.2
  InnerBottom 0.127: v10.05,50.53 10.05,47.68 10.9,46.83 v11.4,46.83
  Bottom 0.127: IC6.19 10.72,51 10.25,50.53 v10.05,50.53
N$LEDB88_IC6_PIN25  (via drill 0.2)
  Top 0.127: v15,49.03 14.9,48.93 14.9,47.93 15.3,47.53 LED88.2
  InnerBottom 0.127: v15,49.03 14.5,49.03 13.9,49.63 v13.9,49.76
  Bottom 0.127: IC6.25 13.72,49.94 v13.9,49.76
N$LEDB89_IC6_PIN53  (via drill 0.2)
  Top 0.127: v3.9,42.33 3.8,42.43 3.56,42.43 2.92,43.08 LED89.2
  Bottom 0.127: IC6.53 3.22,42.92 3.8,42.33 v3.9,42.33
N$LEDB90_IC6_PIN47  (via drill 0.2)
  Top 0.127: v6.65,42.59 6.74,42.59 7.15,43 LED90.2
  Bottom 0.127: IC6.47 6.22,43.02 v6.65,42.59
N$LEDB91_IC6_PIN41  (via drill 0.2)
  Top 0.127: v9.8,42.7 10.23,42.7 10.83,43.3 LED91.2
  Bottom 0.127: IC6.41 9.22,43.35 9.8,42.77 v9.8,42.7
N$LEDB92_IC6_PIN35  (via drill 0.2)
  Top 0.127: v13.95,45.99 13.95,45.44 14.9,44.49 14.9,43.51 15.11,43.3 LED92.2
  Bottom 0.127: IC6.35 12.22,45.04 13.17,45.99 v13.95,45.99
N$LEDB93_IC6_PIN50  (via drill 0.2)
  Top 0.127: LED93.2 3.34,38.65 v3.64,38.65
  InnerBottom 0.127: v4.69,43.03 5.7,43.03 6.15,42.58 6.15,40.19 4.61,38.65 v3.64,38.65
  Bottom 0.127: IC6.50 4.72,43.06 v4.69,43.03
N$LEDB94_IC6_PIN44  (via drill 0.2)
  Top 0.127: LED94.2 7.22,39.13 v8,39.13
  InnerBottom 0.127: v7.7,42.1 7.5,41.9 7.5,39.63 v8,39.13
  Bottom 0.127: IC6.44 7.72,43.41 7.6,43.3 7.6,42.2 v7.7,42.1
N$LEDB95_IC6_PIN38  (via drill 0.2)
  Top 0.127: LED95.2 11.07,39.07 v10.6,39.53
  InnerBottom 0.127: v10.6,39.53 10.1,40.03 10.1,40.83 10.73,41.46 v10.73,42.44
  Bottom 0.127: IC6.38 10.72,42.46 v10.73,42.44
N$LEDB96_IC6_PIN32  (via drill 0.2)
  Top 0.127: LED96.2 15.27,39.07 v14.8,39.53
  InnerBottom 0.127: v14.11,42.68 14.7,42.68 14.7,39.63 v14.8,39.53
  Bottom 0.127: IC6.32 13.72,43.35 14.11,42.96 v14.11,42.68
N$LEDB97_IC7_PIN4  (via drill 0.2 pad 0.4)
  Top 0.127: LED97.2 3.8,33.95 v3.8,33.75
  Bottom 0.127: IC7.4 3.22,33.93 3.4,33.75 v3.8,33.75
N$LEDB98_IC7_PIN10  (via drill 0.2)
  Top 0.127: v6.28,33.69 7.15,34.56 LED98.2
  Bottom 0.127: IC7.10 6.28,34.77 v6.28,33.69
N$LEDB99_IC7_PIN16  (via drill 0.2)
  Top 0.127: v11.84,36.4 12.14,36.1 12.14,35.24 11.73,34.83 LED99.2
  InnerBottom 0.127: v11.84,36.4 11.18,35.75 10.38,35.75 v9.7,36.43
  Bottom 0.127: IC7.16 9.22,35.95 v9.7,36.43
N$LEDB100_IC7_PIN22  (via drill 0.2)
  Top 0.127: LED100.2 15.35,34.57 v15.35,33.75
  InnerBottom 0.127: v15.35,33.75 v12.38,33.75
  Bottom 0.127: IC7.22 12.22,34.03 12.38,33.86 v12.38,33.75
N$LEDB101_IC7_PIN7  (via drill 0.2 pad 0.4)
  Top 0.127: v3.7,30.8 3.12,30.8 LED101.2
  InnerBottom 0.127: v5.02,32.76 4.2,31.94 4.2,31 4,30.8 v3.7,30.8
  Bottom 0.127: IC7.7 4.65,34.77 4.65,33.13 v5.02,32.76
N$LEDB102_IC7_PIN13  (via drill 0.2)
  Top 0.127: v5.4,30 6.55,30 LED102.2
  InnerBottom 0.127: v7.71,33.69 7.71,32.89 5.4,30.59 v5.4,30
  Bottom 0.127: IC7.13 7.72,33.7 v7.71,33.69
N$LEDB103_IC7_PIN19  (via drill 0.2)
  Top 0.127: v11.4,29.9 11.38,29.92 LED103.2
  InnerBottom 0.127: v10.05,33.6 10.05,30.75 10.9,29.9 v11.4,29.9
  Bottom 0.127: IC7.19 10.72,34.07 10.25,33.6 v10.05,33.6
N$LEDB104_IC7_PIN25  (via drill 0.2)
  Top 0.127: v15,32.1 14.9,32 14.9,31 15.3,30.6 LED104.2
  InnerBottom 0.127: v15,32.1 14.5,32.1 13.9,32.7 v13.9,32.82
  Bottom 0.127: IC7.25 13.72,33.01 v13.9,32.82
N$LEDB105_IC7_PIN53  (via drill 0.2)
  Top 0.127: v3.9,25.4 3.8,25.5 3.56,25.5 2.92,26.14 LED105.2
  Bottom 0.127: IC7.53 3.22,25.98 3.8,25.4 v3.9,25.4
N$LEDB106_IC7_PIN47  (via drill 0.2)
  Top 0.127: v6.65,25.65 6.74,25.65 7.15,26.07 LED106.2
  Bottom 0.127: IC7.47 6.22,26.08 v6.65,25.65
N$LEDB107_IC7_PIN41  (via drill 0.2)
  Top 0.127: v9.8,25.76 v9.8,25.77 10.23,25.77 10.83,26.37 LED107.2
  Bottom 0.127: IC7.41 9.22,26.42 9.8,25.84 v9.8,25.76
N$LEDB108_IC7_PIN35  (via drill 0.2)
  Top 0.127: v13.95,29.06 13.95,28.51 14.9,27.56 14.9,26.58 15.11,26.37 LED108.2
  Bottom 0.127: IC7.35 12.22,28.1 13.17,29.06 v13.95,29.06
N$LEDB109_IC7_PIN50  (via drill 0.2)
  Top 0.127: v3.64,21.61 3.12,22.13 LED109.2
  InnerBottom 0.127: v4.69,26.1 5.7,26.1 6.15,25.65 6.15,23.45 4.31,21.61 v3.64,21.61
  Bottom 0.127: IC7.50 4.72,26.12 v4.69,26.1
N$LEDB110_IC7_PIN44  (via drill 0.2)
  Top 0.127: v8,22.2 7.93,22.13 LED110.2
  InnerBottom 0.127: v7.7,25.16 7.5,24.96 7.5,22.7 v8,22.2
  Bottom 0.127: IC7.44 7.72,26.48 7.6,26.36 7.6,25.26 v7.7,25.16
N$LEDB111_IC7_PIN38  (via drill 0.2)
  Top 0.127: LED111.2 11.07,22.13 v10.6,22.6
  InnerBottom 0.127: v10.6,22.6 10.1,23.1 10.1,23.89 10.73,24.52 v10.73,25.51
  Bottom 0.127: IC7.38 10.72,25.53 v10.73,25.51
N$LEDB112_IC7_PIN32  (via drill 0.2)
  Top 0.127: v14.8,22.6 15.27,22.13 LED112.2
  InnerBottom 0.127: v14.11,25.74 14.7,25.74 14.7,22.7 v14.8,22.6
  Bottom 0.127: IC7.32 13.72,26.42 14.11,26.02 v14.11,25.74
N$LEDB113_IC8_PIN4  (via drill 0.2)
  Top 0.127: v3.94,16.8 2.92,17.82 LED113.2
  Bottom 0.127: IC8.4 3.22,17.22 3.64,16.8 v3.94,16.8
N$LEDB114_IC8_PIN10  (via drill 0.2)
  Top 0.127: v6.7,16.8 6.7,17.3 7.14,17.74 LED114.2
  Bottom 0.127: IC8.10 6.2,18.01 6.2,17.18 6.58,16.8 v6.7,16.8
N$LEDB115_IC8_PIN16  (via drill 0.2)
  Top 0.127: v9.3,19.5 10,20.2 10.4,20.2 10.7,19.9 10.7,19.1 10.6,19 10.6,18.3 11,17.9 LED115.2
  Bottom 0.127: IC8.16 9.22,19.42 v9.3,19.5
N$LEDB116_IC8_PIN22  (via drill 0.2)
  Top 0.127: LED116.2 15.62,16.92 v15.5,16.8
  InnerBottom 0.127: v12.2,19.2 14.6,16.8 v15.5,16.8
  Bottom 0.127: IC8.22 12.22,19.18 v12.2,19.2
N$LEDB117_IC8_PIN7  (via drill 0.2)
  Top 0.127: v3.8,13.7 3.77,13.67 LED117.2
  InnerBottom 0.127: v4.7,16.7 4.66,16.66 4.66,14.56 v3.8,13.7
  Bottom 0.127: IC8.7 4.72,16.72 v4.7,16.7
N$LEDB118_IC8_PIN13  (via drill 0.2)
  Top 0.127: v5.76,12.8 6.28,12.8 LED118.2
  InnerBottom 0.127: v7.4,16.8 7.4,16.7 6.2,15.5 6.2,14.74 5.76,14.3 v5.76,12.8
  Bottom 0.127: IC8.13 7.72,17.12 v7.4,16.8
N$LEDB119_IC8_PIN19  (via drill 0.2)
  Top 0.127: v11.4,12.9 11.38,12.92 LED119.2
  InnerBottom 0.127: v10.5,16.8 10.5,13.4 11,12.9 v11.4,12.9
  Bottom 0.127: IC8.19 10.72,17.02 v10.5,16.8
N$LEDB120_IC8_PIN25  (via drill 0.2)
  Top 0.127: LED120.2 15.62,13.32 v15.3,13
  InnerBottom 0.127: v13.7,16.8 13.5,16.6 13.5,13.9 14.4,13 v15.3,13
  Bottom 0.127: IC8.25 13.72,16.82 v13.7,16.8
N$LEDG1_IC1_PIN6  (via drill 0.2 pad 0.4)
  Top 0.127: LED1.1 2.95,137.3 3.42,137.3 3.86,137.74 v4.05,137.74
  Bottom 0.127: IC1.6 4.22,137.57 v4.05,137.74
N$LEDG2_IC1_PIN12  (via drill 0.2)
  Top 0.127: v7.1,138 7.1,137.38 LED2.1
  Bottom 0.127: IC1.12 7.22,137.88 v7.1,138
N$LEDG3_IC1_PIN18  (via drill 0.2)
  Top 0.127: v11.13,138.01 11.13,137.59 LED3.1
  Bottom 0.127: IC1.18 10.22,137.2 10.49,137.47 10.89,137.47 11.13,137.71 v11.13,138.01
N$LEDG4_IC1_PIN24  (via drill 0.2)
  Top 0.127: v15.16,137.97 15.16,137.79 LED4.1
  Bottom 0.127: IC1.24 13.22,137.25 13.42,137.46 14.65,137.46 v15.16,137.97
N$LEDG5_IC1_PIN9  (via drill 0.2 pad 0.4)
  Top 0.127: v3.7,133.1 LED5.1
  InnerBottom 0.127: v5.7,134.8 5.66,134.84 4.54,134.84 3.7,134 v3.7,133.1
  Bottom 0.127: IC1.9 5.72,134.82 v5.7,134.8
N$LEDG6_IC1_PIN15  (via drill 0.2)
  Top 0.127: v9,135.25 9,134.95 LED6.1
  Bottom 0.127: IC1.15 8.72,135.53 v9,135.25
N$LEDG7_IC1_PIN21  (via drill 0.2)
  Top 0.127: v12,133.8 12,133.72 LED7.1
  InnerBottom 0.127: v11.7,135.16 12,134.86 v12,133.8
  Bottom 0.127: IC1.21 11.72,135.62 11.72,135.61 11.72,135.19 v11.7,135.16
N$LEDG8_IC1_PIN27  (via drill 0.2)
  Top 0.127: LED8.1 15.65,133.13 15.65,134.12 v15.35,134.42
  Bottom 0.127: IC1.27 14.72,135.05 v15.35,134.42
N$LEDG9_IC1_PIN51  (via drill 0.2)
  Top 0.127: v3.87,127.7 3.87,128.33 3.33,128.87 LED9.1
  Bottom 0.127: IC1.51 4.22,128.05 v3.87,127.7
N$LEDG10_IC1_PIN45  (via drill 0.2)
  Top 0.127: LED10.1 7.27,128.98 v7.27,129.97
  Bottom 0.127: IC1.45 7.22,129.92 v7.27,129.97
N$LEDG11_IC1_PIN39  (via drill 0.2)
  Top 0.127: v10.6,130.05 11.38,129.27 LED11.1
  Bottom 0.127: IC1.39 10.22,129.67 v10.6,130.05
N$LEDG12_IC1_PIN33  (via drill 0.2)
  Top 0.127: LED12.1 15.62,129.24 14.75,130.1 v14.7,130.1
  Bottom 0.127: IC1.33 13.22,129.7 13.61,130.1 v14.7,130.1
N$LEDG13_IC1_PIN48  (via drill 0.2)
  Top 0.127: v3.65,124.35 3.2,124.35 LED13.1
  InnerBottom 0.127: v5.52,126.96 5.52,125.92 3.95,124.35 v3.65,124.35
  Bottom 0.127: IC1.48 5.72,127.16 v5.52,126.96
N$LEDG14_IC1_PIN42  (via drill 0.2)
  Top 0.127: v8,124.65 7.98,124.63 LED14.1
  InnerBottom 0.127: v9.8,126.65 8,124.84 v8,124.65
  Bottom 0.127: IC1.42 8.72,127.43 9.5,126.65 v9.8,126.65
N$LEDG15_IC1_PIN36  (via drill 0.2)
  Top 0.127: v11.5,125.3 11.38,125.18 LED15.1
  InnerBottom 0.127: v11.5,125.3 11.81,125.61 v11.81,127.09
  Bottom 0.127: IC1.36 11.72,127.98 11.81,127.89 v11.81,127.09
N$LEDG16_IC1_PIN30  (via drill 0.2)
  Top 0.127: v15.3,125.5 15.3,124.95 LED16.1
  InnerBottom 0.127: v15.31,127.36 v15.3,127.35 v15.3,125.5
  Bottom 0.127: IC1.30 14.72,127.96 v15.31,127.36
N$LEDG17_IC2_PIN6  (via drill 0.2 pad 0.4)
  Top 0.127: LED17.1 2.95,120.37 3.42,120.37 3.86,120.81 v4.05,120.81
  Bottom 0.127: IC2.6 4.22,120.64 v4.05,120.81
N$LEDG18_IC2_PIN12  (via drill 0.2)
  Top 0.127: v7.1,121.07 7.1,120.45 LED18.1
  Bottom 0.127: IC2.12 7.22,120.95 v7.1,121.07
N$LEDG19_IC2_PIN18  (via drill 0.2)
  Top 0.127: v11.13,121.08 11.13,120.66 LED19.1
  Bottom 0.127: IC2.18 10.22,120.27 10.49,120.54 10.89,120.54 11.13,120.78 v11.13,121.08
N$LEDG20_IC2_PIN24  (via drill 0.2)
  Top 0.127: v14.66,121.04 14.98,121.04 LED20.1
  Bottom 0.127: IC2.24 13.22,120.32 13.42,120.53 14.15,120.53 v14.66,121.04
N$LEDG21_IC2_PIN9  (via drill 0.2 pad 0.4)
  Top 0.127: v3.7,116.17 LED21.1
  InnerBottom 0.127: v5.7,117.87 5.66,117.91 4.54,117.91 3.7,117.07 v3.7,116.17
  Bottom 0.127: IC2.9 5.72,117.88 v5.7,117.87
N$LEDG22_IC2_PIN15  (via drill 0.2)
  Top 0.127: v9,118.31 9,118.01 LED22.1
  Bottom 0.127: IC2.15 8.72,118.6 v9,118.31
N$LEDG23_IC2_PIN21  (via drill 0.2)
  Top 0.127: v12,116.87 12,116.79 LED23.1
  InnerBottom 0.127: v11.7,118.23 12,117.93 v12,116.87
  Bottom 0.127: IC2.21 11.72,118.69 11.72,118.68 11.72,118.25 v11.7,118.23
N$LEDG24_IC2_PIN27  (via drill 0.2)
  Top 0.127: LED24.1 15.65,116.2 15.65,117.19 v15.35,117.49
  Bottom 0.127: IC2.27 14.72,118.12 v15.35,117.49
N$LEDG25_IC2_PIN51  (via drill 0.2)
  Top 0.127: LED25.1 3.27,111.93 3.87,111.33 v3.87,110.77
  Bottom 0.127: IC2.51 4.22,111.11 v3.87,110.77
N$LEDG26_IC2_PIN45  (via drill 0.2)
  Top 0.127: LED26.1 7.15,112.92 v7.27,113.03
  Bottom 0.127: IC2.45 7.22,112.98 v7.27,113.03
N$LEDG27_IC2_PIN39  (via drill 0.2)
  Top 0.127: LED27.1 11.38,112.34 v10.6,113.12
  Bottom 0.127: IC2.39 10.22,112.74 v10.6,113.12
N$LEDG28_IC2_PIN33  (via drill 0.2)
  Top 0.127: v14.7,113.17 15.62,112.25 LED28.1
  Bottom 0.127: IC2.33 13.22,112.77 13.61,113.17 v14.7,113.17
N$LEDG29_IC2_PIN48  (via drill 0.2)
  Top 0.127: v3.65,107.42 3.2,107.42 LED29.1
  InnerBottom 0.127: v5.52,110.03 5.52,108.19 4.75,107.42 v3.65,107.42
  Bottom 0.127: IC2.48 5.72,110.22 v5.52,110.03
N$LEDG30_IC2_PIN42  (via drill 0.2)
  Top 0.127: v8,107.72 7.98,107.7 LED30.1
  InnerBottom 0.127: v9.8,109.71 8,107.91 v8,107.72
  Bottom 0.127: IC2.42 8.72,110.5 9.5,109.71 v9.8,109.71
N$LEDG31_IC2_PIN36  (via drill 0.2)
  Top 0.127: v11.5,108.37 11.38,108.25 LED31.1
  InnerBottom 0.127: v11.5,108.37 11.81,108.68 v11.81,110.16
  Bottom 0.127: IC2.36 11.72,111.05 11.81,110.96 v11.81,110.16
N$LEDG32_IC2_PIN30  (via drill 0.2)
  Top 0.127: v15.3,108.57 15.3,108.02 LED32.1
  InnerBottom 0.127: v15.31,110.43 15.3,110.42 v15.3,108.57
  Bottom 0.127: IC2.30 14.72,111.03 v15.31,110.43
N$LEDG33_IC3_PIN6  (via drill 0.2 pad 0.4)
  Top 0.127: v4.05,103.87 3.64,103.47 LED33.1
  Bottom 0.127: IC3.6 4.22,103.71 v4.05,103.87
N$LEDG34_IC3_PIN12  (via drill 0.2)
  Top 0.127: v7.1,104.13 7.15,104.08 LED34.1
  Bottom 0.127: IC3.12 7.22,104.02 v7.1,104.13
N$LEDG35_IC3_PIN18  (via drill 0.2)
  Top 0.127: v11.13,104.14 11.13,103.72 LED35.1
  Bottom 0.127: IC3.18 10.22,103.33 10.49,103.6 10.89,103.6 11.13,103.84 v11.13,104.14
N$LEDG36_IC3_PIN24  (via drill 0.2)
  Top 0.127: LED36.1 15.3,103.47 v14.66,104.1
  Bottom 0.127: IC3.24 13.22,103.39 13.42,103.59 14.15,103.59 v14.66,104.1
N$LEDG37_IC3_PIN9  (via drill 0.2 pad 0.4)
  Top 0.127: v3.7,99.23 LED37.1
  InnerBottom 0.127: v5.7,100.93 5.66,100.97 4.54,100.97 3.7,100.13 v3.7,99.23
  Bottom 0.127: IC3.9 5.72,100.95 v5.7,100.93
N$LEDG38_IC3_PIN15  (via drill 0.2)
  Top 0.127: v9,101.38 9,101.08 LED38.1
  Bottom 0.127: IC3.15 8.72,101.66 v9,101.38
N$LEDG39_IC3_PIN21  (via drill 0.2)
  Top 0.127: v12,99.93 12,99.85 LED39.1
  InnerBottom 0.127: v11.7,101.29 12,100.99 v12,99.93
  Bottom 0.127: IC3.21 11.72,101.75 11.72,101.32 v11.7,101.29
N$LEDG40_IC3_PIN27  (via drill 0.2)
  Top 0.127: LED40.1 15.65,99.27 15.65,100.25 v15.35,100.55
  Bottom 0.127: IC3.27 14.72,101.19 v15.35,100.55
N$LEDG41_IC3_PIN51  (via drill 0.2)
  Top 0.127: v3.87,93.83 3.87,94.46 3.33,95 LED41.1
  Bottom 0.127: IC3.51 4.22,94.18 v3.87,93.83
N$LEDG42_IC3_PIN45  (via drill 0.2)
  Top 0.127: LED42.1 7.27,95.12 v7.27,96.1
  Bottom 0.127: IC3.45 7.22,96.05 v7.27,96.1
N$LEDG43_IC3_PIN39  (via drill 0.2)
  Top 0.127: v10.6,96.19 11.38,95.4 LED43.1
  Bottom 0.127: IC3.39 10.22,95.8 v10.6,96.19
N$LEDG44_IC3_PIN33  (via drill 0.2)
  Top 0.127: LED44.1 15.62,95.37 14.75,96.23 v14.7,96.23
  Bottom 0.127: IC3.33 13.22,95.84 13.61,96.23 v14.7,96.23
N$LEDG45_IC3_PIN48  (via drill 0.2)
  Top 0.127: v3.65,90.48 3.2,90.48 LED45.1
  InnerBottom 0.127: v5.52,93.09 5.52,91.05 4.95,90.48 v3.65,90.48
  Bottom 0.127: IC3.48 5.72,93.29 v5.52,93.09
N$LEDG46_IC3_PIN42  (via drill 0.2)
  Top 0.127: LED46.1 7.17,90.78 v8,90.78
  InnerBottom 0.127: v9.8,92.78 8,90.98 v8,90.78
  Bottom 0.127: IC3.42 8.72,93.56 9.5,92.78 v9.8,92.78
N$LEDG47_IC3_PIN36  (via drill 0.2)
  Top 0.127: LED47.1 11.5,90.88 v11.5,91.43
  InnerBottom 0.127: v11.5,91.43 11.81,91.74 v11.81,93.22
  Bottom 0.127: IC3.36 11.72,94.12 11.81,94.02 v11.81,93.22
N$LEDG48_IC3_PIN30  (via drill 0.2)
  Top 0.127: v15.3,91.63 15.3,91.08 LED48.1 | LED48.1
  InnerBottom 0.127: v15.31,93.5 15.3,93.48 v15.3,91.63
  Bottom 0.127: IC3.30 14.72,94.09 v15.31,93.5
N$LEDG49_IC4_PIN6  (via drill 0.2 pad 0.4)
  Top 0.127: LED49.1 2.95,86.5 3.42,86.5 3.86,86.94 v4.05,86.94
  Bottom 0.127: IC4.6 4.22,86.77 v4.05,86.94
N$LEDG50_IC4_PIN12  (via drill 0.2)
  Top 0.127: v7.1,87.2 7.1,86.58 LED50.1
  Bottom 0.127: IC4.12 7.22,87.08 v7.1,87.2
N$LEDG51_IC4_PIN18  (via drill 0.2)
  Top 0.127: v11.13,87.21 11.13,86.79 LED51.1
  Bottom 0.127: IC4.18 10.22,86.4 10.49,86.67 10.89,86.67 11.13,86.91 v11.13,87.21
N$LEDG52_IC4_PIN24  (via drill 0.2)
  Top 0.127: v14.66,87.17 14.98,87.17 LED52.1
  Bottom 0.127: IC4.24 13.22,86.45 13.42,86.66 14.15,86.66 v14.66,87.17
N$LEDG53_IC4_PIN9  (via drill 0.2 pad 0.4)
  Top 0.127: v3.7,82.3 LED53.1
  InnerBottom 0.127: v5.7,84 5.66,84.04 4.54,84.04 3.7,83.2 v3.7,82.3
  Bottom 0.127: IC4.9 5.72,84.02 v5.7,84
N$LEDG54_IC4_PIN15  (via drill 0.2)
  Top 0.127: v9,84.45 9,84.15 LED54.1
  Bottom 0.127: IC4.15 8.72,84.73 v9,84.45
N$LEDG55_IC4_PIN21  (via drill 0.2)
  Top 0.127: v12,83 12,82.92 LED55.1
  InnerBottom 0.127: v11.7,84.36 12,84.06 v12,83
  Bottom 0.127: IC4.21 11.72,84.82 11.72,84.81 11.72,84.38 v11.7,84.36
N$LEDG56_IC4_PIN27  (via drill 0.2)
  Top 0.127: LED56.1 15.65,82.33 15.65,83.32 v15.35,83.62
  Bottom 0.127: IC4.27 14.72,84.25 v15.35,83.62
N$LEDG57_IC4_PIN51  (via drill 0.2)
  Top 0.127: v3.87,76.9 3.87,77.53 3.33,78.07 LED57.1
  Bottom 0.127: IC4.51 4.22,77.25 v3.87,76.9
N$LEDG58_IC4_PIN45  (via drill 0.2)
  Top 0.127: LED58.1 7.27,78.18 v7.27,79.17
  Bottom 0.127: IC4.45 7.22,79.12 v7.27,79.17
N$LEDG59_IC4_PIN39  (via drill 0.2)
  Top 0.127: v10.6,79.25 11.38,78.47 LED59.1
  Bottom 0.127: IC4.39 10.22,78.87 v10.6,79.25
N$LEDG60_IC4_PIN33  (via drill 0.2)
  Top 0.127: LED60.1 15.62,78.44 14.75,79.3 v14.7,79.3
  Bottom 0.127: IC4.33 13.22,78.9 13.61,79.3 v14.7,79.3
N$LEDG61_IC4_PIN48  (via drill 0.2)
  Top 0.127: v3.65,73.55 3.2,73.55 LED61.1
  InnerBottom 0.127: v5.52,76.16 5.52,74.12 4.65,73.25 3.95,73.25 v3.65,73.55
  Bottom 0.127: IC4.48 5.72,76.36 v5.52,76.16
N$LEDG62_IC4_PIN42  (via drill 0.2)
  Top 0.127: v8,73.85 7.98,73.83 LED62.1
  InnerBottom 0.127: v9.8,75.85 8,74.04 v8,73.85
  Bottom 0.127: IC4.42 8.72,76.63 9.5,75.85 v9.8,75.85
N$LEDG63_IC4_PIN36  (via drill 0.2)
  Top 0.127: v11.5,74.5 11.38,74.38 LED63.1
  InnerBottom 0.127: v11.5,74.5 11.81,74.81 v11.81,76.29
  Bottom 0.127: IC4.36 11.72,77.18 11.81,77.09 v11.81,76.29
N$LEDG64_IC4_PIN30  (via drill 0.2)
  Top 0.127: v15.3,74.7 15.3,74.15 LED64.1
  InnerBottom 0.127: v15.31,76.56 v15.3,76.55 v15.3,74.7
  Bottom 0.127: IC4.30 14.72,77.16 v15.31,76.56
N$LEDG65_IC5_PIN6  (via drill 0.2 pad 0.4)
  Top 0.127: LED65.1 2.95,69.57 3.42,69.57 3.86,70.01 v4.05,70.01
  Bottom 0.127: IC5.6 4.22,69.84 v4.05,70.01
N$LEDG66_IC5_PIN12  (via drill 0.2)
  Top 0.127: v7.1,70.27 7.1,69.65 LED66.1
  Bottom 0.127: IC5.12 7.22,70.15 v7.1,70.27
N$LEDG67_IC5_PIN18  (via drill 0.2)
  Top 0.127: v11.13,70.28 11.13,69.86 LED67.1
  Bottom 0.127: IC5.18 10.22,69.47 10.49,69.74 10.89,69.74 11.13,69.98 v11.13,70.28
N$LEDG68_IC5_PIN24  (via drill 0.2)
  Top 0.127: v14.66,70.24 14.98,70.24 LED68.1
  Bottom 0.127: IC5.24 13.22,69.52 13.42,69.73 14.15,69.73 v14.66,70.24
N$LEDG69_IC5_PIN9  (via drill 0.2 pad 0.4)
  Top 0.127: v3.7,65.37 LED69.1
  InnerBottom 0.127: v5.7,67.07 5.66,67.11 4.54,67.11 3.7,66.27 v3.7,65.37
  Bottom 0.127: IC5.9 5.72,67.08 v5.7,67.07
N$LEDG70_IC5_PIN15  (via drill 0.2)
  Top 0.127: v9,67.51 9,67.21 LED70.1
  Bottom 0.127: IC5.15 8.72,67.8 v9,67.51
N$LEDG71_IC5_PIN21  (via drill 0.2)
  Top 0.127: v12,66.07 12,65.99 LED71.1
  InnerBottom 0.127: v11.7,67.43 12,67.13 v12,66.07
  Bottom 0.127: IC5.21 11.72,67.89 11.72,67.88 11.72,67.45 v11.7,67.43
N$LEDG72_IC5_PIN27  (via drill 0.2)
  Top 0.127: LED72.1 15.65,65.4 15.65,66.39 v15.35,66.69
  Bottom 0.127: IC5.27 14.72,67.32 v15.35,66.69
N$LEDG73_IC5_PIN51  (via drill 0.2)
  Top 0.127: LED73.1 3.37,61.13 3.87,60.63 v3.87,59.97
  Bottom 0.127: IC5.51 4.22,60.31 v3.87,59.97
N$LEDG74_IC5_PIN45  (via drill 0.2)
  Top 0.127: LED74.1 7.15,62.12 v7.27,62.23
  Bottom 0.127: IC5.45 7.22,62.18 v7.27,62.23
N$LEDG75_IC5_PIN39  (via drill 0.2)
  Top 0.127: LED75.1 11.38,61.54 v10.6,62.32
  Bottom 0.127: IC5.39 10.22,61.94 v10.6,62.32
N$LEDG76_IC5_PIN33  (via drill 0.2)
  Top 0.127: v14.7,62.37 14.75,62.37 15.62,61.5 LED76.1
  Bottom 0.127: IC5.33 13.22,61.97 13.61,62.37 v14.7,62.37
N$LEDG77_IC5_PIN48  (via drill 0.2)
  Top 0.127: v3.75,56.62 3.2,56.62 LED77.1
  InnerBottom 0.127: v5.52,59.23 5.52,57.39 4.75,56.62 v3.75,56.62
  Bottom 0.127: IC5.48 5.72,59.42 v5.52,59.23
N$LEDG78_IC5_PIN42  (via drill 0.2)
  Top 0.127: v8,56.92 7.98,56.9 LED78.1
  InnerBottom 0.127: v9.8,58.91 8,57.11 v8,56.92
  Bottom 0.127: IC5.42 8.72,59.7 9.5,58.91 v9.8,58.91
N$LEDG79_IC5_PIN36  (via drill 0.2)
  Top 0.127: v11.5,57.57 11.38,57.45 LED79.1
  InnerBottom 0.127: v11.5,57.57 11.81,57.88 v11.81,59.36
  Bottom 0.127: IC5.36 11.72,60.25 11.81,60.16 v11.81,59.36
N$LEDG80_IC5_PIN30  (via drill 0.2)
  Top 0.127: v15.3,57.77 15.3,57.22 LED80.1
  InnerBottom 0.127: v15.31,59.63 15.3,59.62 v15.3,57.77
  Bottom 0.127: IC5.30 14.72,60.22 v15.31,59.63
N$LEDG81_IC6_PIN6  (via drill 0.2 pad 0.4)
  Top 0.127: LED81.1 3.64,52.67 v4.05,53.07
  Bottom 0.127: IC6.6 4.22,52.91 v4.05,53.07
N$LEDG82_IC6_PIN12  (via drill 0.2)
  Top 0.127: LED82.1 7.1,52.72 v7.1,53.33
  Bottom 0.127: IC6.12 7.22,53.22 v7.1,53.33
N$LEDG83_IC6_PIN18  (via drill 0.2)
  Top 0.127: v11.13,53.34 11.13,52.92 LED83.1
  Bottom 0.127: IC6.18 10.22,52.53 10.49,52.8 10.89,52.8 11.13,53.04 v11.13,53.34
N$LEDG84_IC6_PIN24  (via drill 0.2)
  Top 0.127: LED84.1 15.3,52.67 v14.66,53.3
  Bottom 0.127: IC6.24 13.22,52.59 13.42,52.79 14.15,52.79 v14.66,53.3
N$LEDG85_IC6_PIN9  (via drill 0.2 pad 0.4)
  Top 0.127: v3.7,48.43 LED85.1
  InnerBottom 0.127: v5.7,50.13 5.66,50.17 4.74,50.17 3.7,49.13 v3.7,48.43
  Bottom 0.127: IC6.9 5.72,50.15 v5.7,50.13
N$LEDG86_IC6_PIN15  (via drill 0.2)
  Top 0.127: v9,50.58 9,50.28 LED86.1
  Bottom 0.127: IC6.15 8.72,50.86 v9,50.58
N$LEDG87_IC6_PIN21  (via drill 0.2)
  Top 0.127: v12,49.13 12,49.05 LED87.1
  InnerBottom 0.127: v11.7,50.49 12,50.19 v12,49.13
  Bottom 0.127: IC6.21 11.72,50.95 11.72,50.52 v11.7,50.49
N$LEDG88_IC6_PIN27  (via drill 0.2)
  Top 0.127: LED88.1 15.65,48.47 15.65,49.45 v15.35,49.75
  Bottom 0.127: IC6.27 14.72,50.39 v15.35,49.75
N$LEDG89_IC6_PIN51  (via drill 0.2)
  Top 0.127: v3.87,43.03 3.87,43.66 3.33,44.2 LED89.1
  Bottom 0.127: IC6.51 4.22,43.38 v3.87,43.03
N$LEDG90_IC6_PIN45  (via drill 0.2)
  Top 0.127: LED90.1 7.27,44.32 v7.27,45.3
  Bottom 0.127: IC6.45 7.22,45.25 v7.27,45.3
N$LEDG91_IC6_PIN39  (via drill 0.2)
  Top 0.127: v10.6,45.39 11.38,44.6 LED91.1
  Bottom 0.127: IC6.39 10.22,45 v10.6,45.39
N$LEDG92_IC6_PIN33  (via drill 0.2)
  Top 0.127: LED92.1 15.62,44.57 14.75,45.43 v14.7,45.43
  Bottom 0.127: IC6.33 13.22,45.04 13.61,45.43 v14.7,45.43
N$LEDG93_IC6_PIN48  (via drill 0.2)
  Top 0.127: v3.65,39.68 3.2,39.68 LED93.1 | LED93.1
  InnerBottom 0.127: v5.52,42.29 5.52,40.25 4.55,39.28 4.05,39.28 v3.65,39.68
  Bottom 0.127: IC6.48 5.72,42.49 v5.52,42.29
N$LEDG94_IC6_PIN42  (via drill 0.2)
  Top 0.127: v8,39.98 7.98,39.97 LED94.1 | LED94.1
  InnerBottom 0.127: v9.8,41.98 8,40.18 v8,39.98
  Bottom 0.127: IC6.42 8.72,42.76 9.5,41.98 v9.8,41.98
N$LEDG95_IC6_PIN36  (via drill 0.2)
  Top 0.127: v11.5,40.63 11.38,40.52 LED95.1
  InnerBottom 0.127: v11.5,40.63 11.81,40.94 v11.81,42.42
  Bottom 0.127: IC6.36 11.72,43.32 11.81,43.22 v11.81,42.42
N$LEDG96_IC6_PIN30  (via drill 0.2)
  Top 0.127: v15.3,40.83 15.62,40.52 LED96.1
  InnerBottom 0.127: v15.31,42.7 15.3,42.68 v15.3,40.83
  Bottom 0.127: IC6.30 14.72,43.29 v15.31,42.7
N$LEDG97_IC7_PIN6  (via drill 0.2 pad 0.4)
  Top 0.127: LED97.1 2.95,35.7 3.42,35.7 3.86,36.14 v4.05,36.14
  Bottom 0.127: IC7.6 4.22,35.97 v4.05,36.14
N$LEDG98_IC7_PIN12  (via drill 0.2)
  Top 0.127: v7.1,36.4 7.1,35.78 LED98.1
  Bottom 0.127: IC7.12 7.22,36.28 v7.1,36.4
N$LEDG99_IC7_PIN18  (via drill 0.2)
  Top 0.127: v11.13,36.41 11.13,35.99 LED99.1
  Bottom 0.127: IC7.18 10.22,35.6 10.49,35.87 10.89,35.87 11.13,36.11 v11.13,36.41
N$LEDG100_IC7_PIN24  (via drill 0.2)
  Top 0.127: v15.16,36.37 15.16,36.19 LED100.1